# Altium schematic sheet Power Source.SchDoc: Power Source & Charger
size A4; SheetNumber: 2; SheetTotal: 37
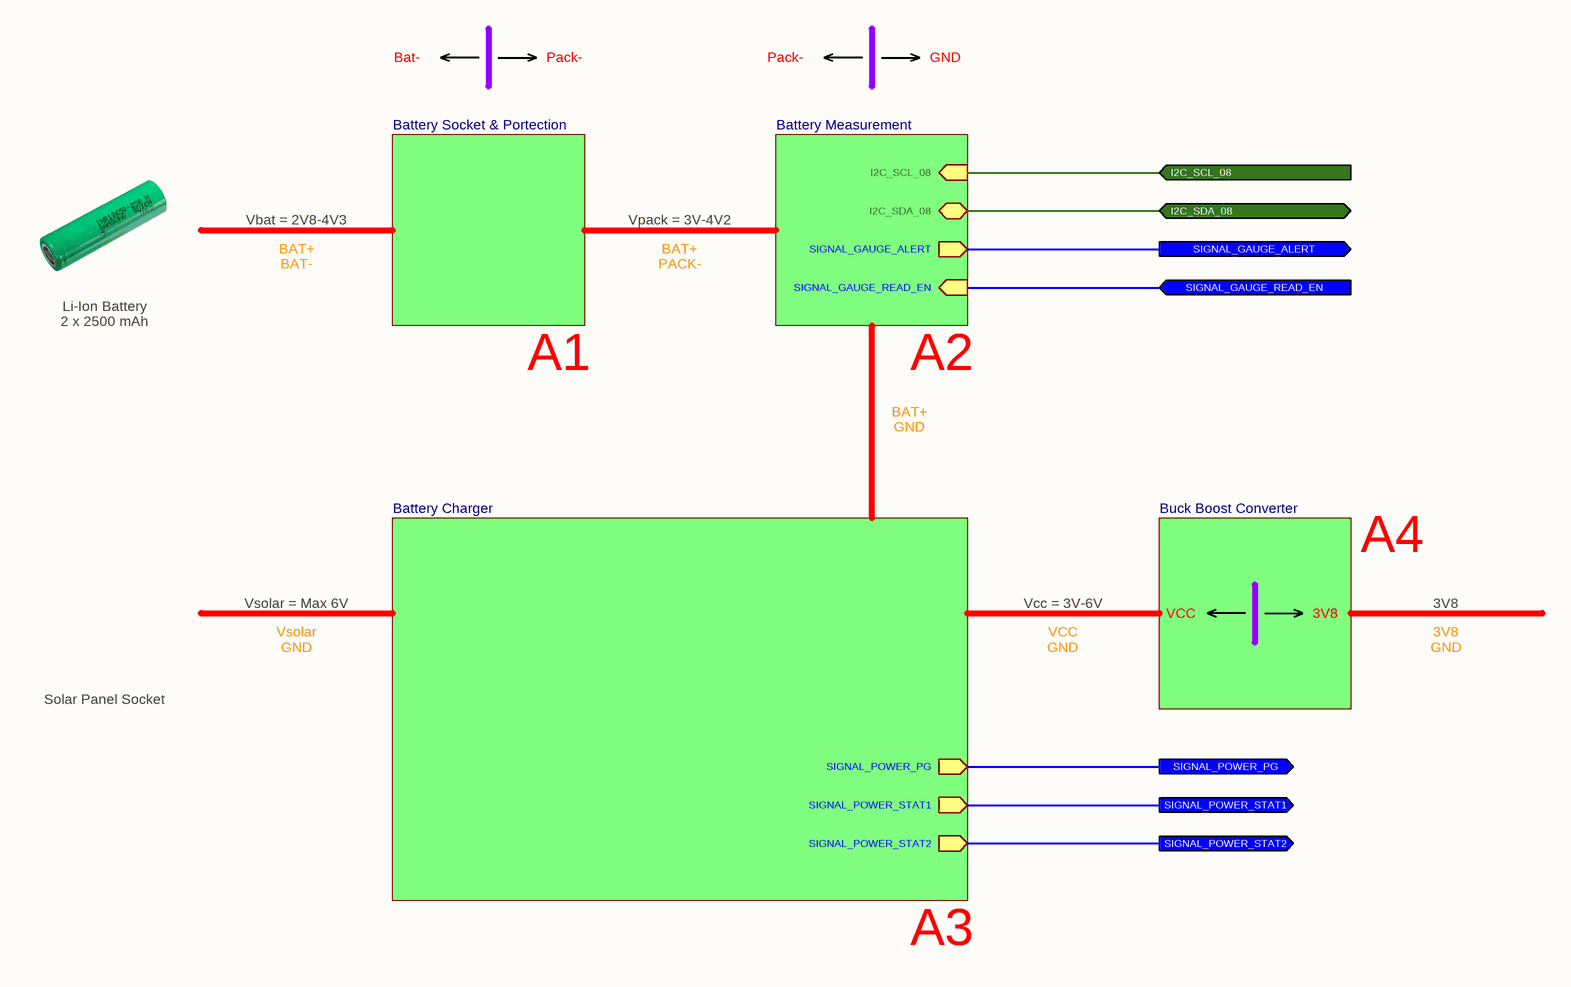
[diagram p0: Power Source.SchDoc]

## Sub-sheets
Battery Charger = Battery Charger.SchDoc: SIGNAL_POWER_STAT2 (out), SIGNAL_POWER_STAT1 (out), SIGNAL_POWER_PG (out)
Battery Measurement = Battery Measurement.SchDoc: SIGNAL_GAUGE_READ_EN (in), SIGNAL_GAUGE_ALERT (out), I2C_SCL_08 (in), I2C_SDA_08 (bidir)
Battery Socket & Portection = Battery Feed and Socket.SchDoc: no entries
Buck Boost Converter = Buck Boost Converter.SchDoc: no entries

## Ports
I2C_SCL_08 (in), I2C_SDA_08 (bidir), SIGNAL_GAUGE_ALERT (out), SIGNAL_GAUGE_READ_EN (in), SIGNAL_POWER_PG (out), SIGNAL_POWER_STAT1 (out), SIGNAL_POWER_STAT2 (out)

## Nets
I2C_SCL_08: port I2C_SCL_08, sheet Battery Measurement/I2C_SCL_08
I2C_SDA_08: port I2C_SDA_08, sheet Battery Measurement/I2C_SDA_08
SIGNAL_GAUGE_ALERT: port SIGNAL_GAUGE_ALERT, sheet Battery Measurement/SIGNAL_GAUGE_ALERT
SIGNAL_GAUGE_READ_EN: port SIGNAL_GAUGE_READ_EN, sheet Battery Measurement/SIGNAL_GAUGE_READ_EN
SIGNAL_POWER_PG: port SIGNAL_POWER_PG, sheet Battery Charger/SIGNAL_POWER_PG
SIGNAL_POWER_STAT1: port SIGNAL_POWER_STAT1, sheet Battery Charger/SIGNAL_POWER_STAT1
SIGNAL_POWER_STAT2: port SIGNAL_POWER_STAT2, sheet Battery Charger/SIGNAL_POWER_STAT2

## Notes on the sheet
- Bat-
- Pack-
- GND
- Vbat = 2V8-4V3
- Vpack = 3V-4V2
- Li-Ion Battery
  2 x 2500 mAh
- BAT+
  BAT-
- BAT+
  PACK-
- A1
- BAT+
  GND
- A2
- A4
- Vsolar = Max 6V
- Vcc = 3V-6V
- VCC
- 3V8
- Solar Panel Socket
- Vsolar
  GND
- VCC
  GND
- 3V8
  GND
- A3
- Title
- Size:
- Date:
- Number:
- Time:
- Revision:
- Sheet
- of
- File: